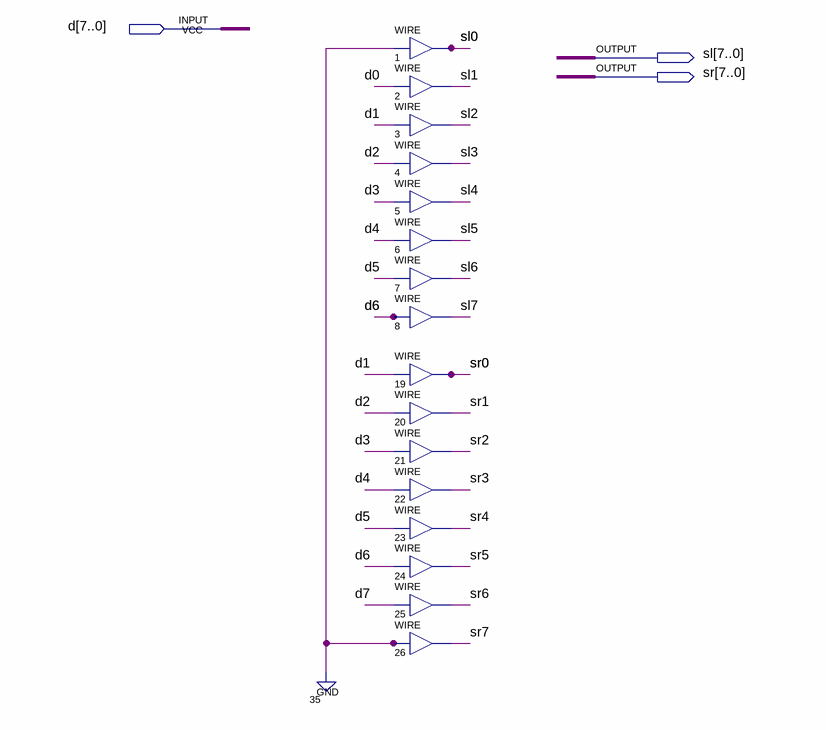
[diagram p0: schematic sheet]
// Quartus schematic wire_ex.bdf as structural Verilog: 16 symbols, 3 pins
module wire_ex (
  input  [7:0] d,
  output [7:0] sl,
  output [7:0] sr
);

  assign sl[0] = 1'b0;  // WIRE 1
  assign sl[1] = d[0];  // WIRE 2
  assign sl[2] = d[1];  // WIRE 3
  assign sl[3] = d[2];  // WIRE 4
  assign sl[4] = d[3];  // WIRE 5
  assign sl[5] = d[4];  // WIRE 6
  assign sl[6] = d[5];  // WIRE 7
  assign sl[7] = d[6];  // WIRE 8
  assign sr[0] = d[1];  // WIRE 19
  assign sr[1] = d[2];  // WIRE 20
  assign sr[2] = d[3];  // WIRE 21
  assign sr[3] = d[4];  // WIRE 22
  assign sr[4] = d[5];  // WIRE 23
  assign sr[5] = d[6];  // WIRE 24
  assign sr[6] = d[7];  // WIRE 25
  assign sr[7] = 1'b0;  // WIRE 26
endmodule
